# Altium schematic sheet PHONE.SchDoc
size A3
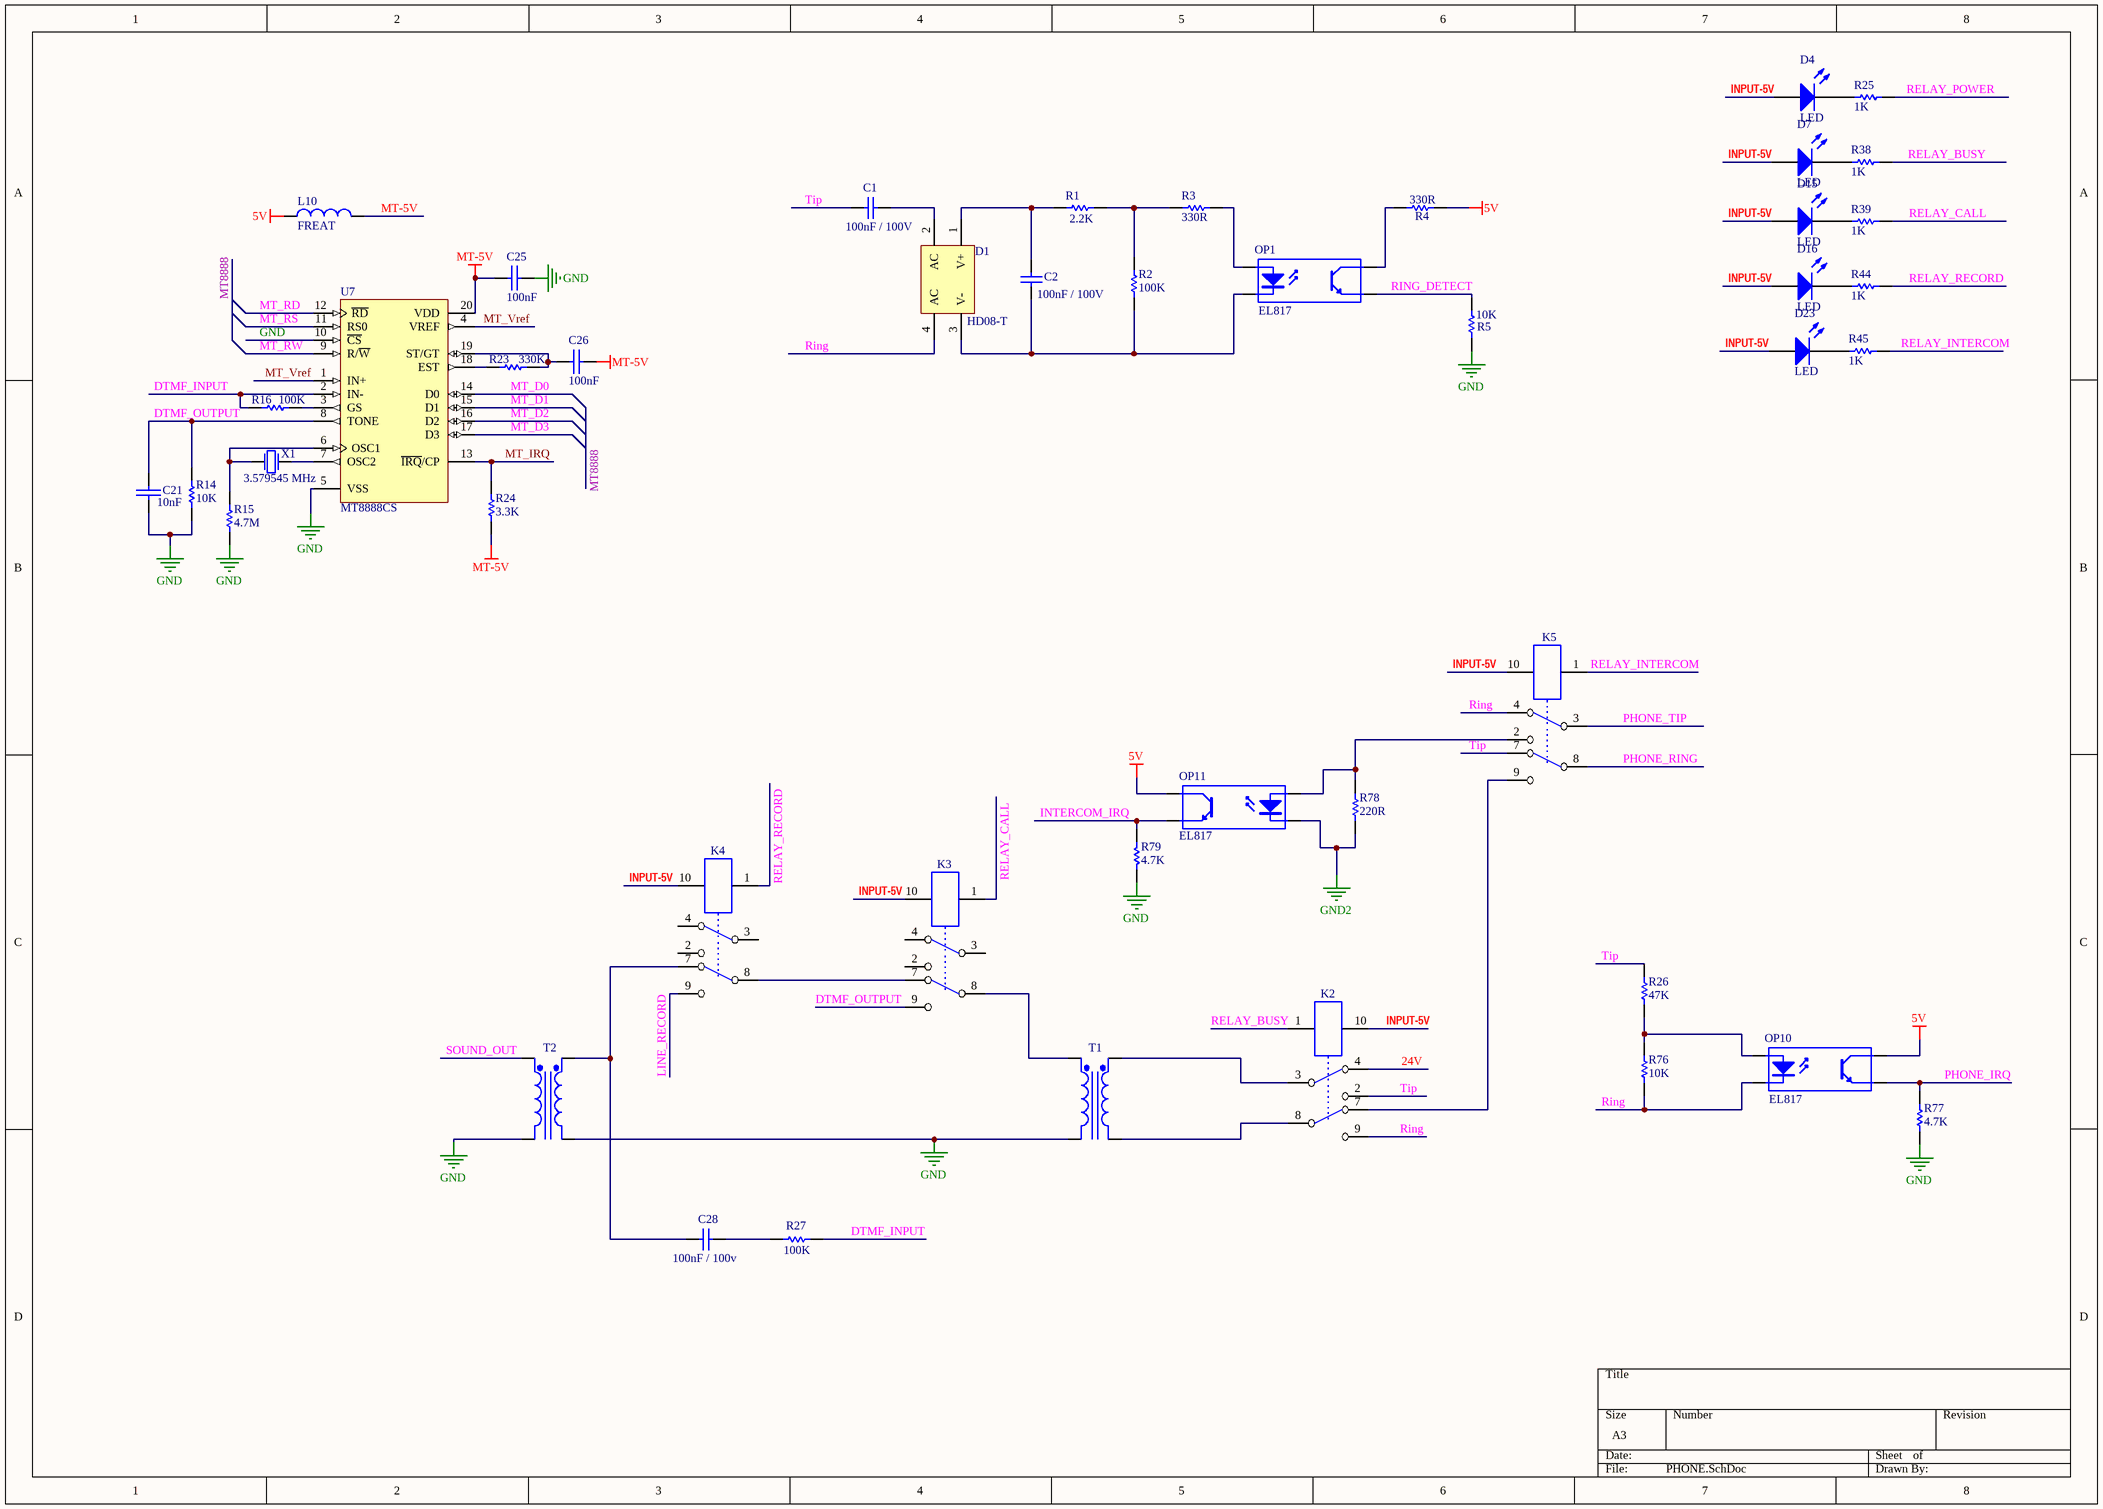
[diagram p0: PHONE.SchDoc]

## Parts
C1  100nF / 100V  [RAD-0.3]
C2  100nF / 100V  [RAD-0.3]
C21  10nF  [0805c]
C25  100nF  [0805c]
C26  100nF  [0805c]
C28  value 100nF / 100v  [1206]  (hidden comment: 100uF / 100V)
D1  HD08-T  [HD08-T]
D4  LED  [0805d]
D7  LED  [0805d]
D15  LED  [0805d]
D16  LED  [0805d]
D23  LED  [0805d]
K2  RELAY 5V  [RELAY G6H]  (value not drawn)
K3  RELAY 5V  [RELAY G6H]  (value not drawn)
K4  RELAY 5V  [RELAY G6H]  (value not drawn)
K5  RELAY 5V  [RELAY G6H]  (value not drawn)
L10  FREAT  [1206]
OP1  EL817  [EL817]
OP10  EL817  [EL817]
OP11  EL817  [EL817]
R1  2.2K  [0805]
R2  100K  [0805]
R3  330R  [0805]
R4  330R  [0805]
R5  10K  [0805]
R14  10K  [0805]
R15  4.7M  [0805]
R16  100K  [0805]
R23  value 330K  [0805]  (hidden comment: 374K)
R24  3.3K  [0805]
R25  1K  [0805]
R26  47K  [0805]
R27  100K  [0805]
R38  1K  [0805]
R39  1K  [0805]
R44  1K  [0805]
R45  1K  [0805]
R76  10K  [0805]
R77  4.7K  [0805]
R78  value 220R  [0805]  (hidden comment: 220)
R79  4.7K  [0805]
T1  TRANCE 300 :300  [trance]  (value not drawn)
T2  TRANCE 300 :300  [trance]  (value not drawn)
U7  MT8888CS  [SOIC20_N]
X1  3.579545 MHz  [crystal]

## Nets
5V: L10.2 OP10.4(C) OP11.4(C) R4.2
GND: C21.2 C25.1 R5.1 R14.1 R15.1 R77.2 R79.2 T1.2(Pri-) T2.2(Pri-) T2.4(Sec-) U7.5(VSS) U7.10(~{CS})
GND2: OP11.2(K) R78.2
MT-5V: C25.2 C26.1 L10.1 R24.1 U7.20(VDD)
24V: K2.4(NC1)
DTMF_INPUT: R16.2 R27.1 U7.2(IN-)
DTMF_OUTPUT: C21.1 K3.9(NO2) R14.2 U7.8(TONE)
INPUT-5V: D4.1(A) D7.1(A) D15.1(A) D16.1(A) D23.1(A) K2.10(-) K3.10(-) K4.10(-) K5.10(-)
INTERCOM_IRQ: OP11.3(E) R79.1
LINE_RECORD: K4.9(NO2)
MT_D0: U7.14(D0)
MT_D1: U7.15(D1)
MT_D2: U7.16(D2)
MT_D3: U7.17(D3)
MT_IRQ: R24.2 U7.13(~{IRQ}/CP)
MT_RD: U7.12(~{RD})
MT_RS: U7.11(RS0)
MT_RW: U7.9(R/~{W})
MT_Vref: U7.1(IN+) U7.4(VREF)
PHONE_IRQ: OP10.3(E) R77.1
PHONE_RING: K5.8(C2)
PHONE_TIP: K5.3(C1)
RELAY_BUSY: K2.1(+) R38.2
RELAY_CALL: K3.1(+) R39.2
RELAY_INTERCOM: K5.1(+) R45.2
RELAY_POWER: R25.2
RELAY_RECORD: K4.1(+) R44.2
Ring: D1.4(AC) K2.9(NO2) K5.4(NC1) OP10.2(K) R76.2
RING_DETECT: OP1.3(E) R5.2
SOUND_OUT: T2.1(Pri+)
Tip: C1.2 K2.2(NO1) K5.7(NC2) R26.2
NetC1_1: C1.1 D1.2(AC)
NetC2_1: C2.1 D1.3(V-) OP1.2(K) R2.2
NetC2_2: C2.2 D1.1(V+) R1.1
NetC26_2: C26.2 R23.1 U7.19(ST/GT)
NetC28_1: C28.1 K4.7(NC2) T2.3(Sec+)
NetC28_2: C28.2 R27.2
NetD4_2: D4.2(K) R25.1
NetD7_2: D7.2(K) R38.1
NetD15_2: D15.2(K) R39.1
NetD16_2: D16.2(K) R44.1
NetD23_2: D23.2(K) R45.1
NetK2_3: K2.3(C1) T1.3(Sec+)
NetK2_7: K2.7(NC2) K5.9(NO2)
NetK2_8: K2.8(C2) T1.4(Sec-)
NetK3_7: K3.7(NC2) K4.8(C2)
NetK3_8: K3.8(C2) T1.1(Pri+)
NetK5_2: K5.2(NO1) OP11.1(A) R78.1
NetOP1_1: OP1.1(A) R3.2
NetOP1_4: OP1.4(C) R4.1
NetOP10_1: OP10.1(A) R26.1 R76.1
NetR1_2: R1.2 R2.1 R3.1
NetR15_2: R15.2 U7.6(OSC1) X1.1(P1)
NetR16_1: R16.1 U7.3(GS)
NetR23_2: R23.2 U7.18(EST)
NetU7_7: U7.7(OSC2) X1.2(P2)

Not connected (* = marked no-connect by the designer): K3 2(NO1) 3(C1) 4(NC1); K4 2(NO1) 3(C1) 4(NC1)

## Buses and harness runs
bus MT8888

## Library data of the parts
C1 C2 C28 = Cap: Capacitor; Published: 8-Jun-2000; LatestRevisionDate: 17-Jul-2002; LatestRevisionNote: Re-released for DXP Platform.; PackageReference: RAD-0.3; Publisher: Altium Limited
C21 C25 C26 = CAP
D1 = Bridge2: Diode Bridge; Published: 24-Mar-1999; LatestRevisionDate: 17-Jul-2002; LatestRevisionNote: Re-released for DXP Platform.; PackageReference: D-46_6A; Publisher: Altium Limited; PackageDescription: Bridge Rectifier; 4 Terminals; Body 16.8 x 16.8 mm (typ); Pitch 10.67 mm
D4 D7 D15 D16 D23 = LED1: Typical RED GaAs LED; Published: 8-Jun-2000; LatestRevisionDate: 08-Jul-2005; LatestRevisionNote: Mech Layer 1 removed.; PackageReference: LED-1; Publisher: Altium Limited
K2-K5 = RELAY DPDT-G6HU
L10 = Inductor: Code_IEC: 1005; Value: 250mA; Published: 8-Jun-2000; LatestRevisionDate: 29-May-2009; LatestRevisionNote: IPC-7351 Footprint Added.; PackageReference: 0402-A; Publisher: Altium Limited; PackageDescription: Chip Inductor; Code_JEITA: 0402
OP1 OP10 OP11 = Optoisolator1: 4-Pin Phototransistor Optocoupler; Published: 24-Mar-1999; LatestRevisionDate: 04-Mar-2005; LatestRevisionNote: Sch pins 3 & 4 Swapped.; DatasheetVersion: Nov-2003; PackageReference: DIP-4; Publisher: Altium Limited
R1-R5 R14-R16 R23 R24 R26 R27 R76-R79 = Res Semi: Semiconductor Resistor; Published: 8-Jun-2000; LatestRevisionDate: 17-Jul-2002; LatestRevisionNote: Re-released for DXP Platform.; PackageReference: AXIAL-0.5; Publisher: Altium Limited
  R2: Value: 100K
  R3: Value: 330R
  R14 R76: PackageDescription: Axial Device, Thru-Hole; 2 Leads; 0.5 in Pin Spacing; Value: 10K
  R15: PackageDescription: Axial Device, Thru-Hole; 2 Leads; 0.5 in Pin Spacing; Value: 4.7M
  R16 R27: PackageDescription: Axial Device, Thru-Hole; 2 Leads; 0.5 in Pin Spacing; Value: 100K
  R23 R78: PackageDescription: Axial Device, Thru-Hole; 2 Leads; 0.5 in Pin Spacing
  R24: PackageDescription: Axial Device, Thru-Hole; 2 Leads; 0.5 in Pin Spacing; Value: 3.3K
  R26: Value: 47K
  R77 R79: PackageDescription: Axial Device, Thru-Hole; 2 Leads; 0.5 in Pin Spacing; Value: 4.7K
R25 R38 R39 R44 R45 = Res1: Resistor; Published: 8-Jun-2000; LatestRevisionDate: 17-Jul-2002; LatestRevisionNote: Re-released for DXP Platform.; PackageReference: AXIAL-0.3; Publisher: Altium Limited
T1 T2 = Trans Ideal: Transformer (Ideal); Published: 8-Jun-2000; LatestRevisionDate: 17-Jul-2002; LatestRevisionNote: Re-released for DXP Platform.; PackageReference: TRF_4; Publisher: Altium Limited
U7 = MT8888CS: Integrated DTMF Transceiver with Intel Micro Interface; Published: 8-Jun-2000; LatestRevisionDate: 13-Apr-2006; LatestRevisionNote: IPC-7351 Footprint Added.; DatasheetVersion: Issue 6 March 1997; PackageVersion: 1997; PackageReference: SOIC20; Publisher: Altium Limited; PackageDescription: 20-Pin Small Outline Integrated Circuit 1.27 mm Pitch; Code_JEDEC: MS-013-AC; Code_IPC: SOIC127P1030-20; ComponentLink1Description: Manufacturer Link; ComponentLink1URL: http://products.zarlink.com; ComponentLink2Description: Datasheet; ComponentLink2URL: http://assets.zarlink.com/DS/zarlink_MT8888C_JUN_05.pdf
X1 = 16.000MHZ: Crystal Oscillator; Section Code: 18201307; Part Field 2: HC49; Part Field 4: 1ppm